# EasyEDA Pro project 自动泊车系统_2025-07-10.epro

# Schematic Schematic1
Board Name: Board1; Create Date: 2025-05-09; Page Name: P1_1; Project Name: 自动泊车系统; Schematic Name: Schematic1; Update Date: 2025-05-11; Add into BOM: yes; Company: 深圳嘉立创科技发展有限公司; Convert to PCB: yes; Drawed: 嘉立创EDA; Page Size: A3; Part Number: JLCPCB-001; Reviewed: 嘉立创EDA; Version: V0.1
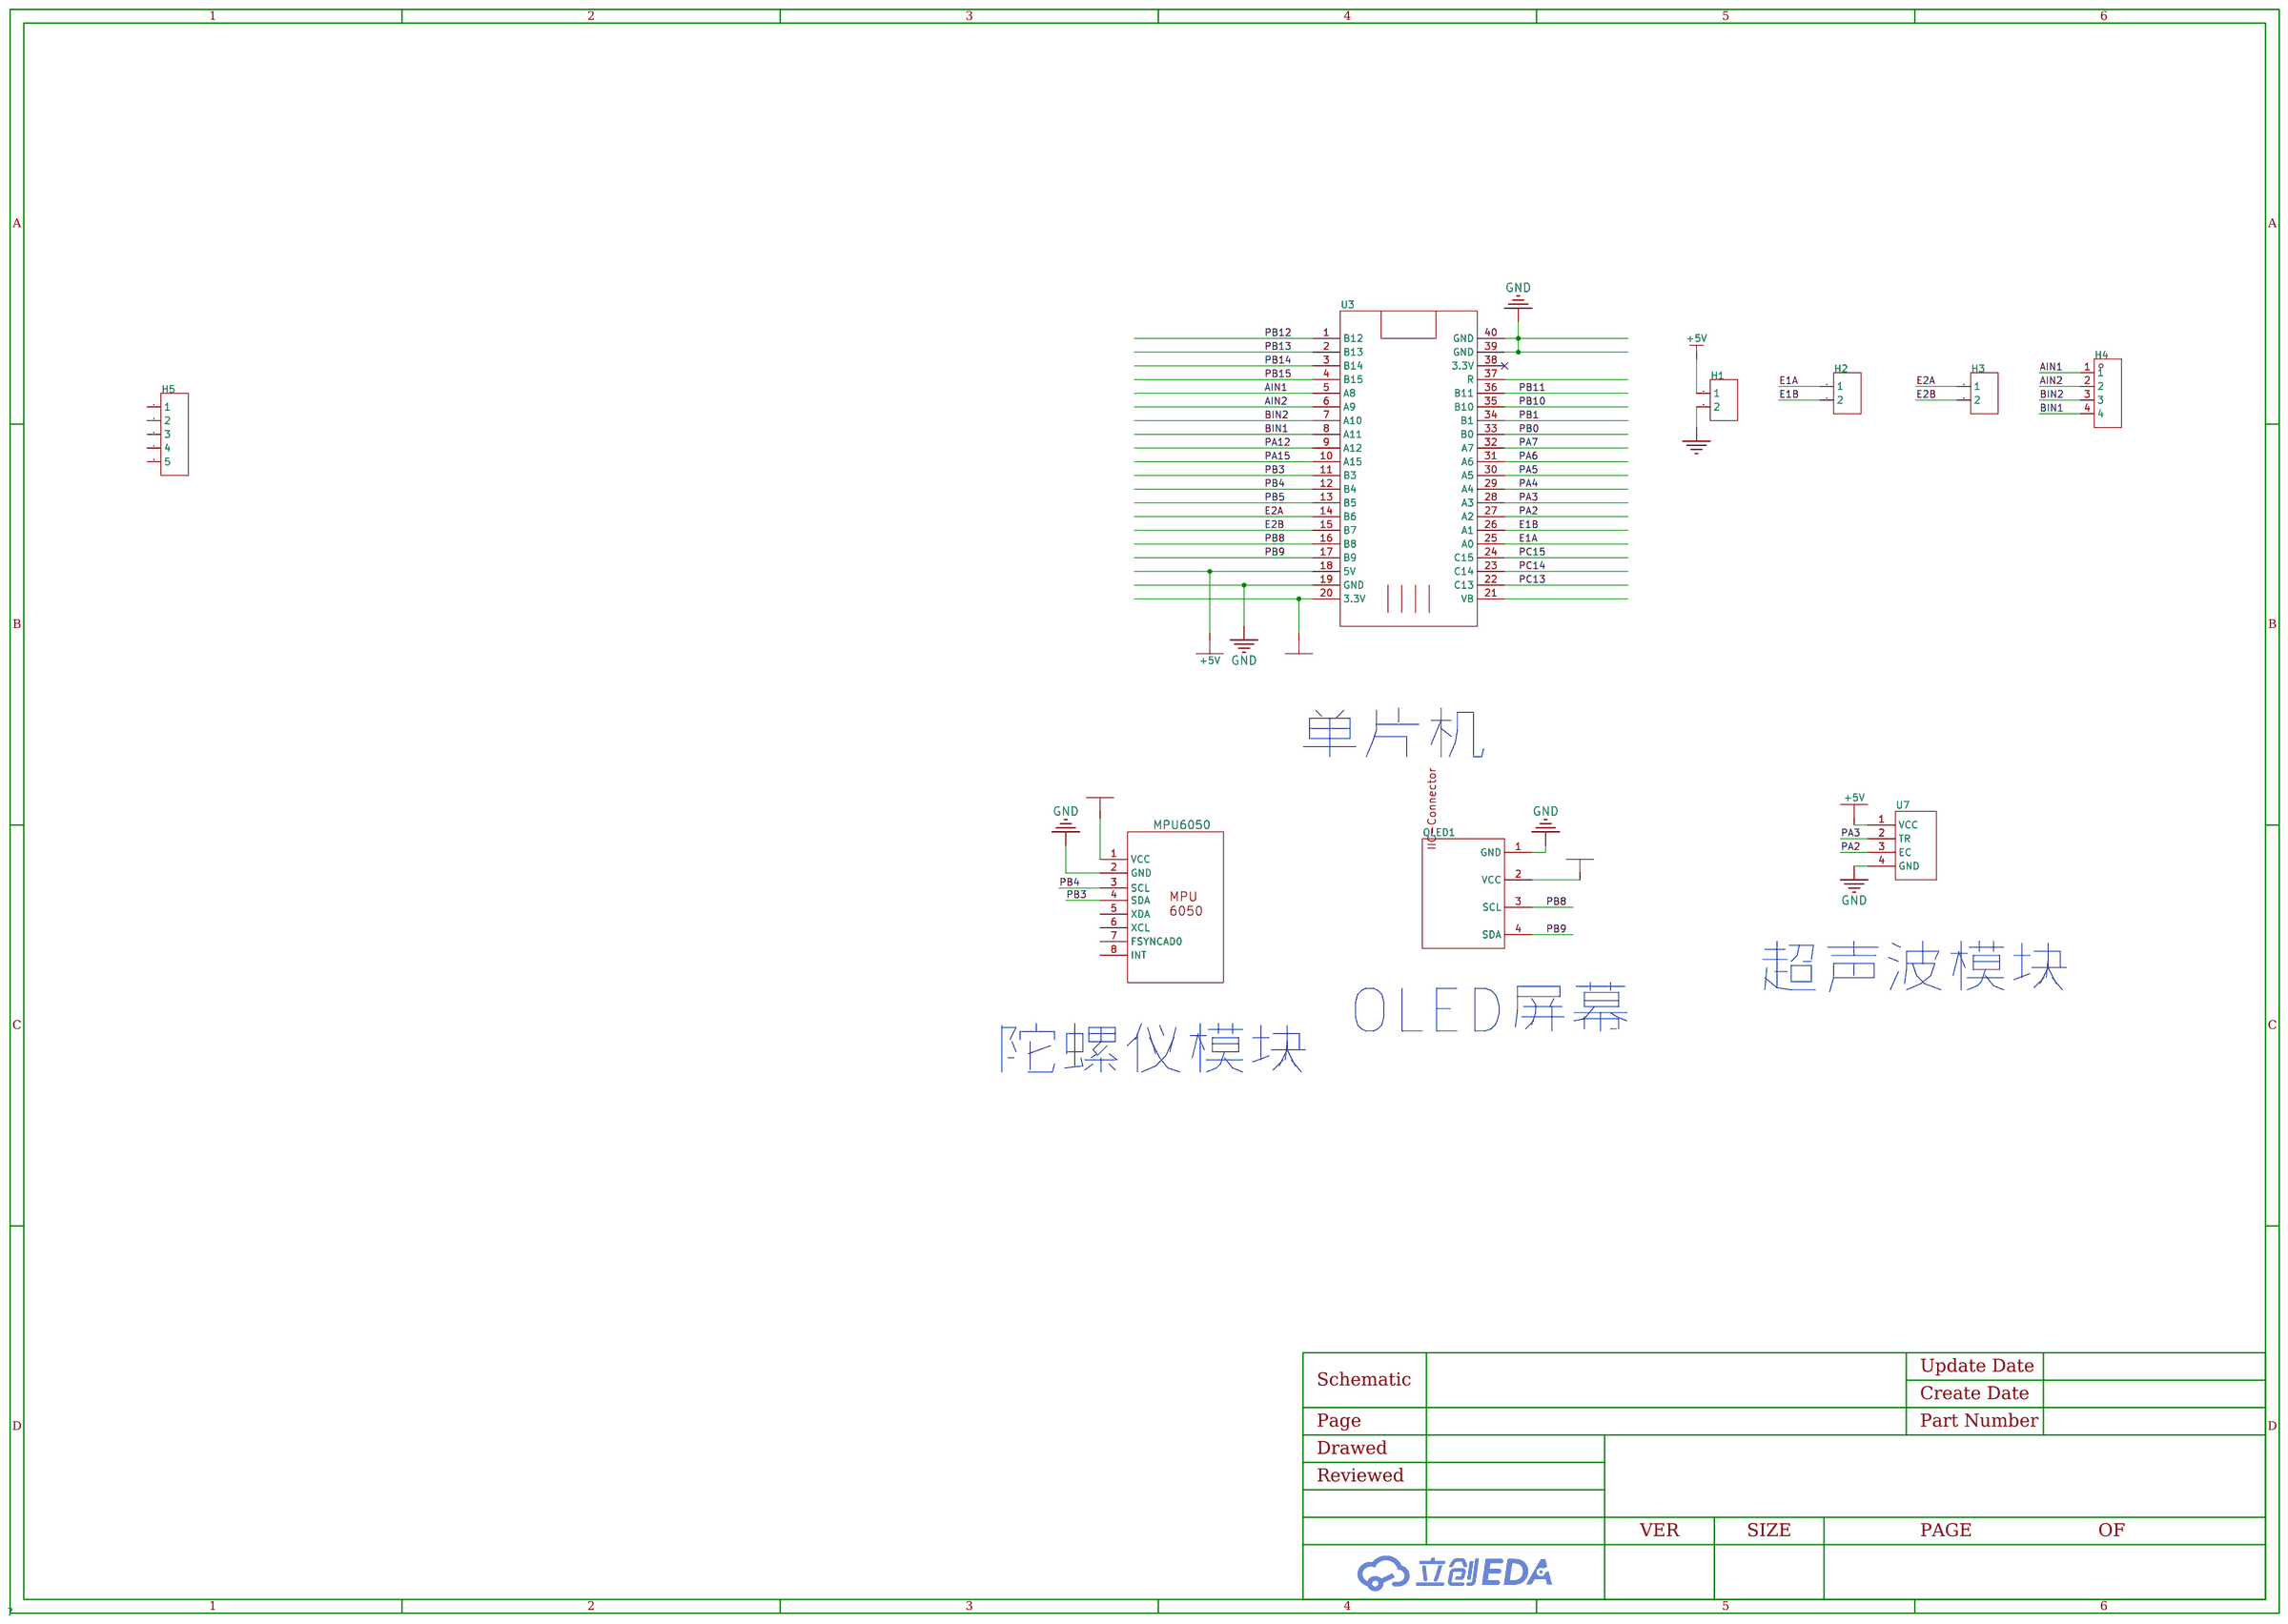
[diagram p0: schematic sheet]

## Parts
H1  -  [HDR-TH_2P-P2.54-V-F]
H2  -  [HDR-TH_2P-P2.54-V-F]
H3  -  [HDR-TH_2P-P2.54-V-F]
H4  -  [HDR-TH_4P-P2.54-V-F]
H5  -  [HDR-TH_5P-P2.54-V-F]
OLED1  -  [0.96OLED_4P]
P1  MPU6050  [MPU6050]
U3  -  [STM32F103C8T6核心板]
U7  -  [排母-4P]

## Library data of the parts
H1-H3 = HDR-F_2.54_1x2P: Supplier Part: C49661; Supplier Footprint: 插件
H4 = HDR-F_2.54_1x4P: Supplier Part: C2718488; Supplier Footprint: 插件
H5 = HDR-F_2.54_1x5P: Supplier Part: C50950; Supplier Footprint: 插件
OLED1 = 0.96OLED_4P: LCSC Part Name: 0.96OLED_4P_MODULE_JX; Supplier Part: C9900004566; Manufacturer Part: 0.96OLED_4P_MODULE_JX; Supplier Footprint: THrough hole; JLCPCB Part Class: Extended Part; Supplier: LCSC
P1 = MPU6050
U3 = stm32f103c8t6最小系统板
U7 = HC-SR04_1

## Nets
+3.3V: OLED1.2(VCC) P1.1(VCC) U3.20(3.3V)
+5V: H1.1 U3.18(5V) U7.1(VCC)
GND: H1.2 OLED1.1(GND) P1.2(GND) U3.19(GND) U3.39(GND) U3.40(GND) U7.4(GND)
AIN1: H4.1 U3.5(A8)
AIN2: H4.2 U3.6(A9)
BIN1: H4.4 U3.8(A11)
BIN2: H4.3 U3.7(A10)
E1A: H2.1 U3.25(A0)
E1B: H2.2 U3.26(A1)
E2A: H3.1 U3.14(B6)
E2B: H3.2 U3.15(B7)
PA2: U3.27(A2) U7.3(EC)
PA3: U3.28(A3) U7.2(TR)
PA4: U3.29(A4)
PA5: U3.30(A5)
PA6: U3.31(A6)
PA7: U3.32(A7)
PA12: U3.9(A12)
PA15: U3.10(A15)
PB0: U3.33(B0)
PB1: U3.34(B1)
PB3: P1.4(SDA) U3.11(B3)
PB4: P1.3(SCL) U3.12(B4)
PB5: U3.13(B5)
PB8: OLED1.3(SCL) U3.16(B8)
PB9: OLED1.4(SDA) U3.17(B9)
PB10: U3.35(B10)
PB11: U3.36(B11)
PB12: U3.1(B12)
PB13: U3.2(B13)
PB14: U3.3(B14)
PB15: U3.4(B15)
PC13: U3.22(C13)
PC14: U3.23(C14)
PC15: U3.24(C15)

Not connected (* = marked no-connect by the designer): H5 1 2 3 4 5; P1 5(XDA) 6(XCL) 7(FSYNCAD0) 8(INT); U3 21(VB) 37(R) 38(3.3V)*

## Notes on the sheet
- 单片机
- 超声波模块
- OLED屏幕
- 陀螺仪模块

# Board PCB1
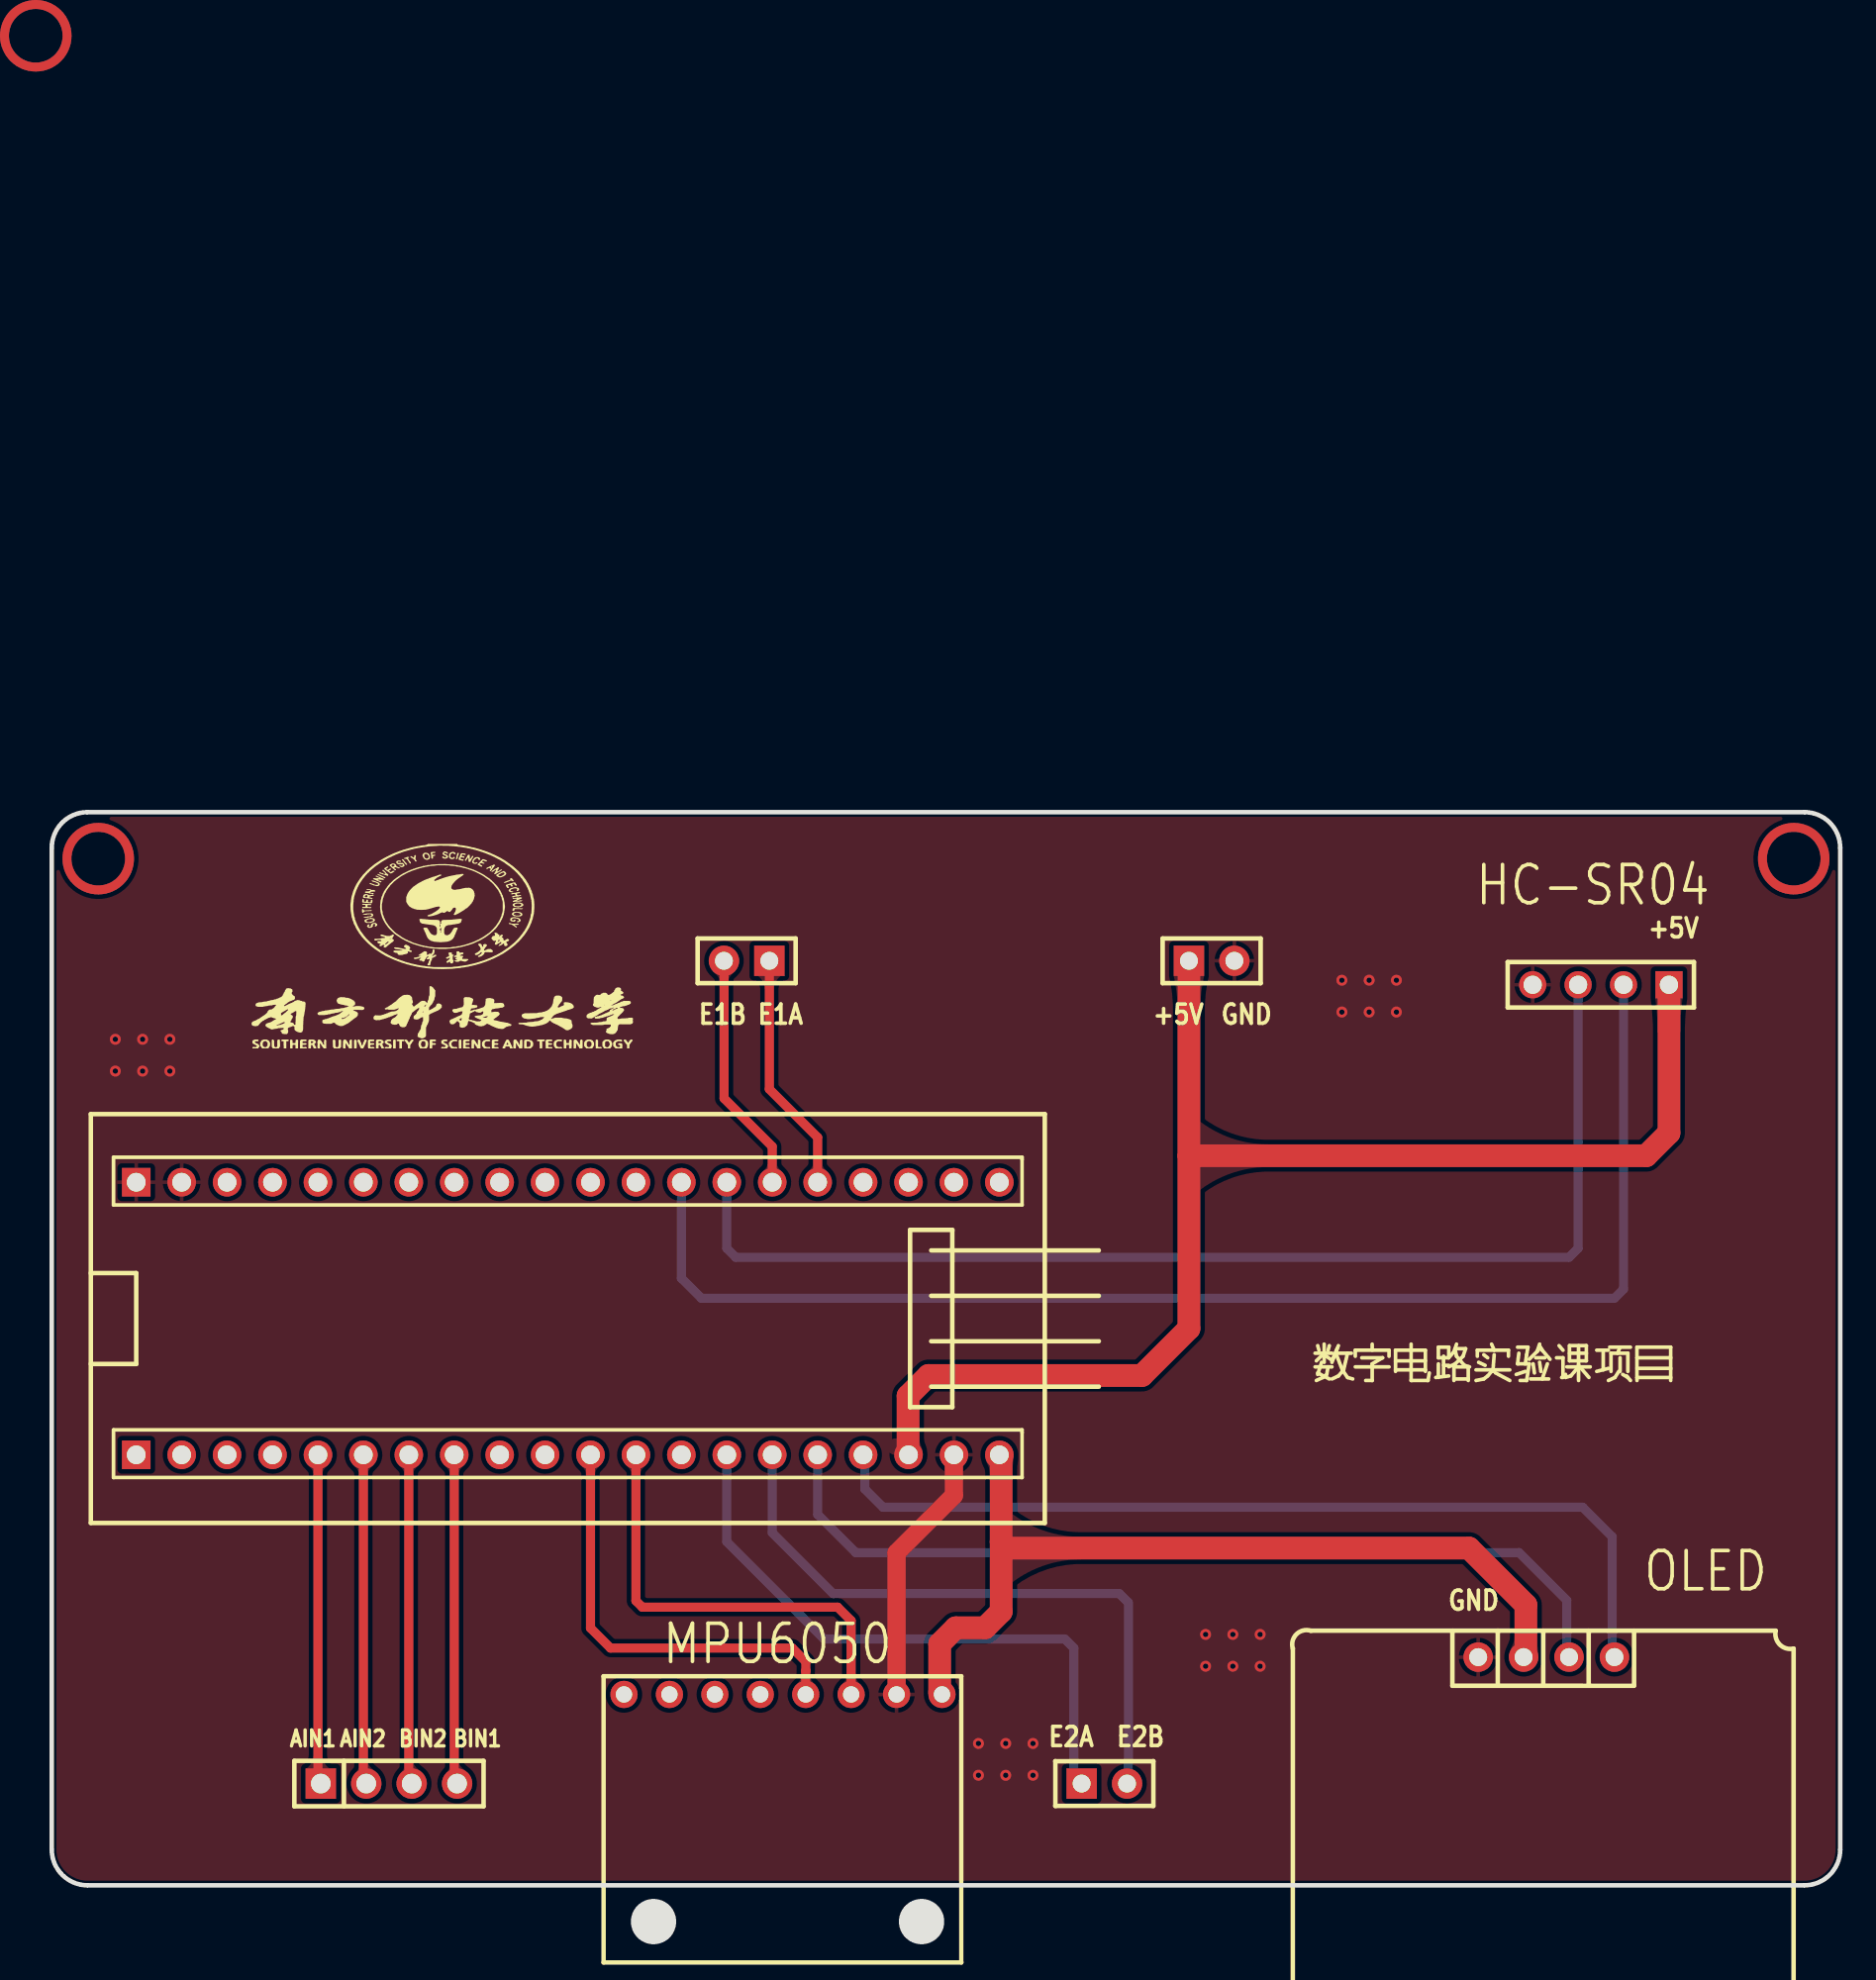
[diagram p1: board, top side]
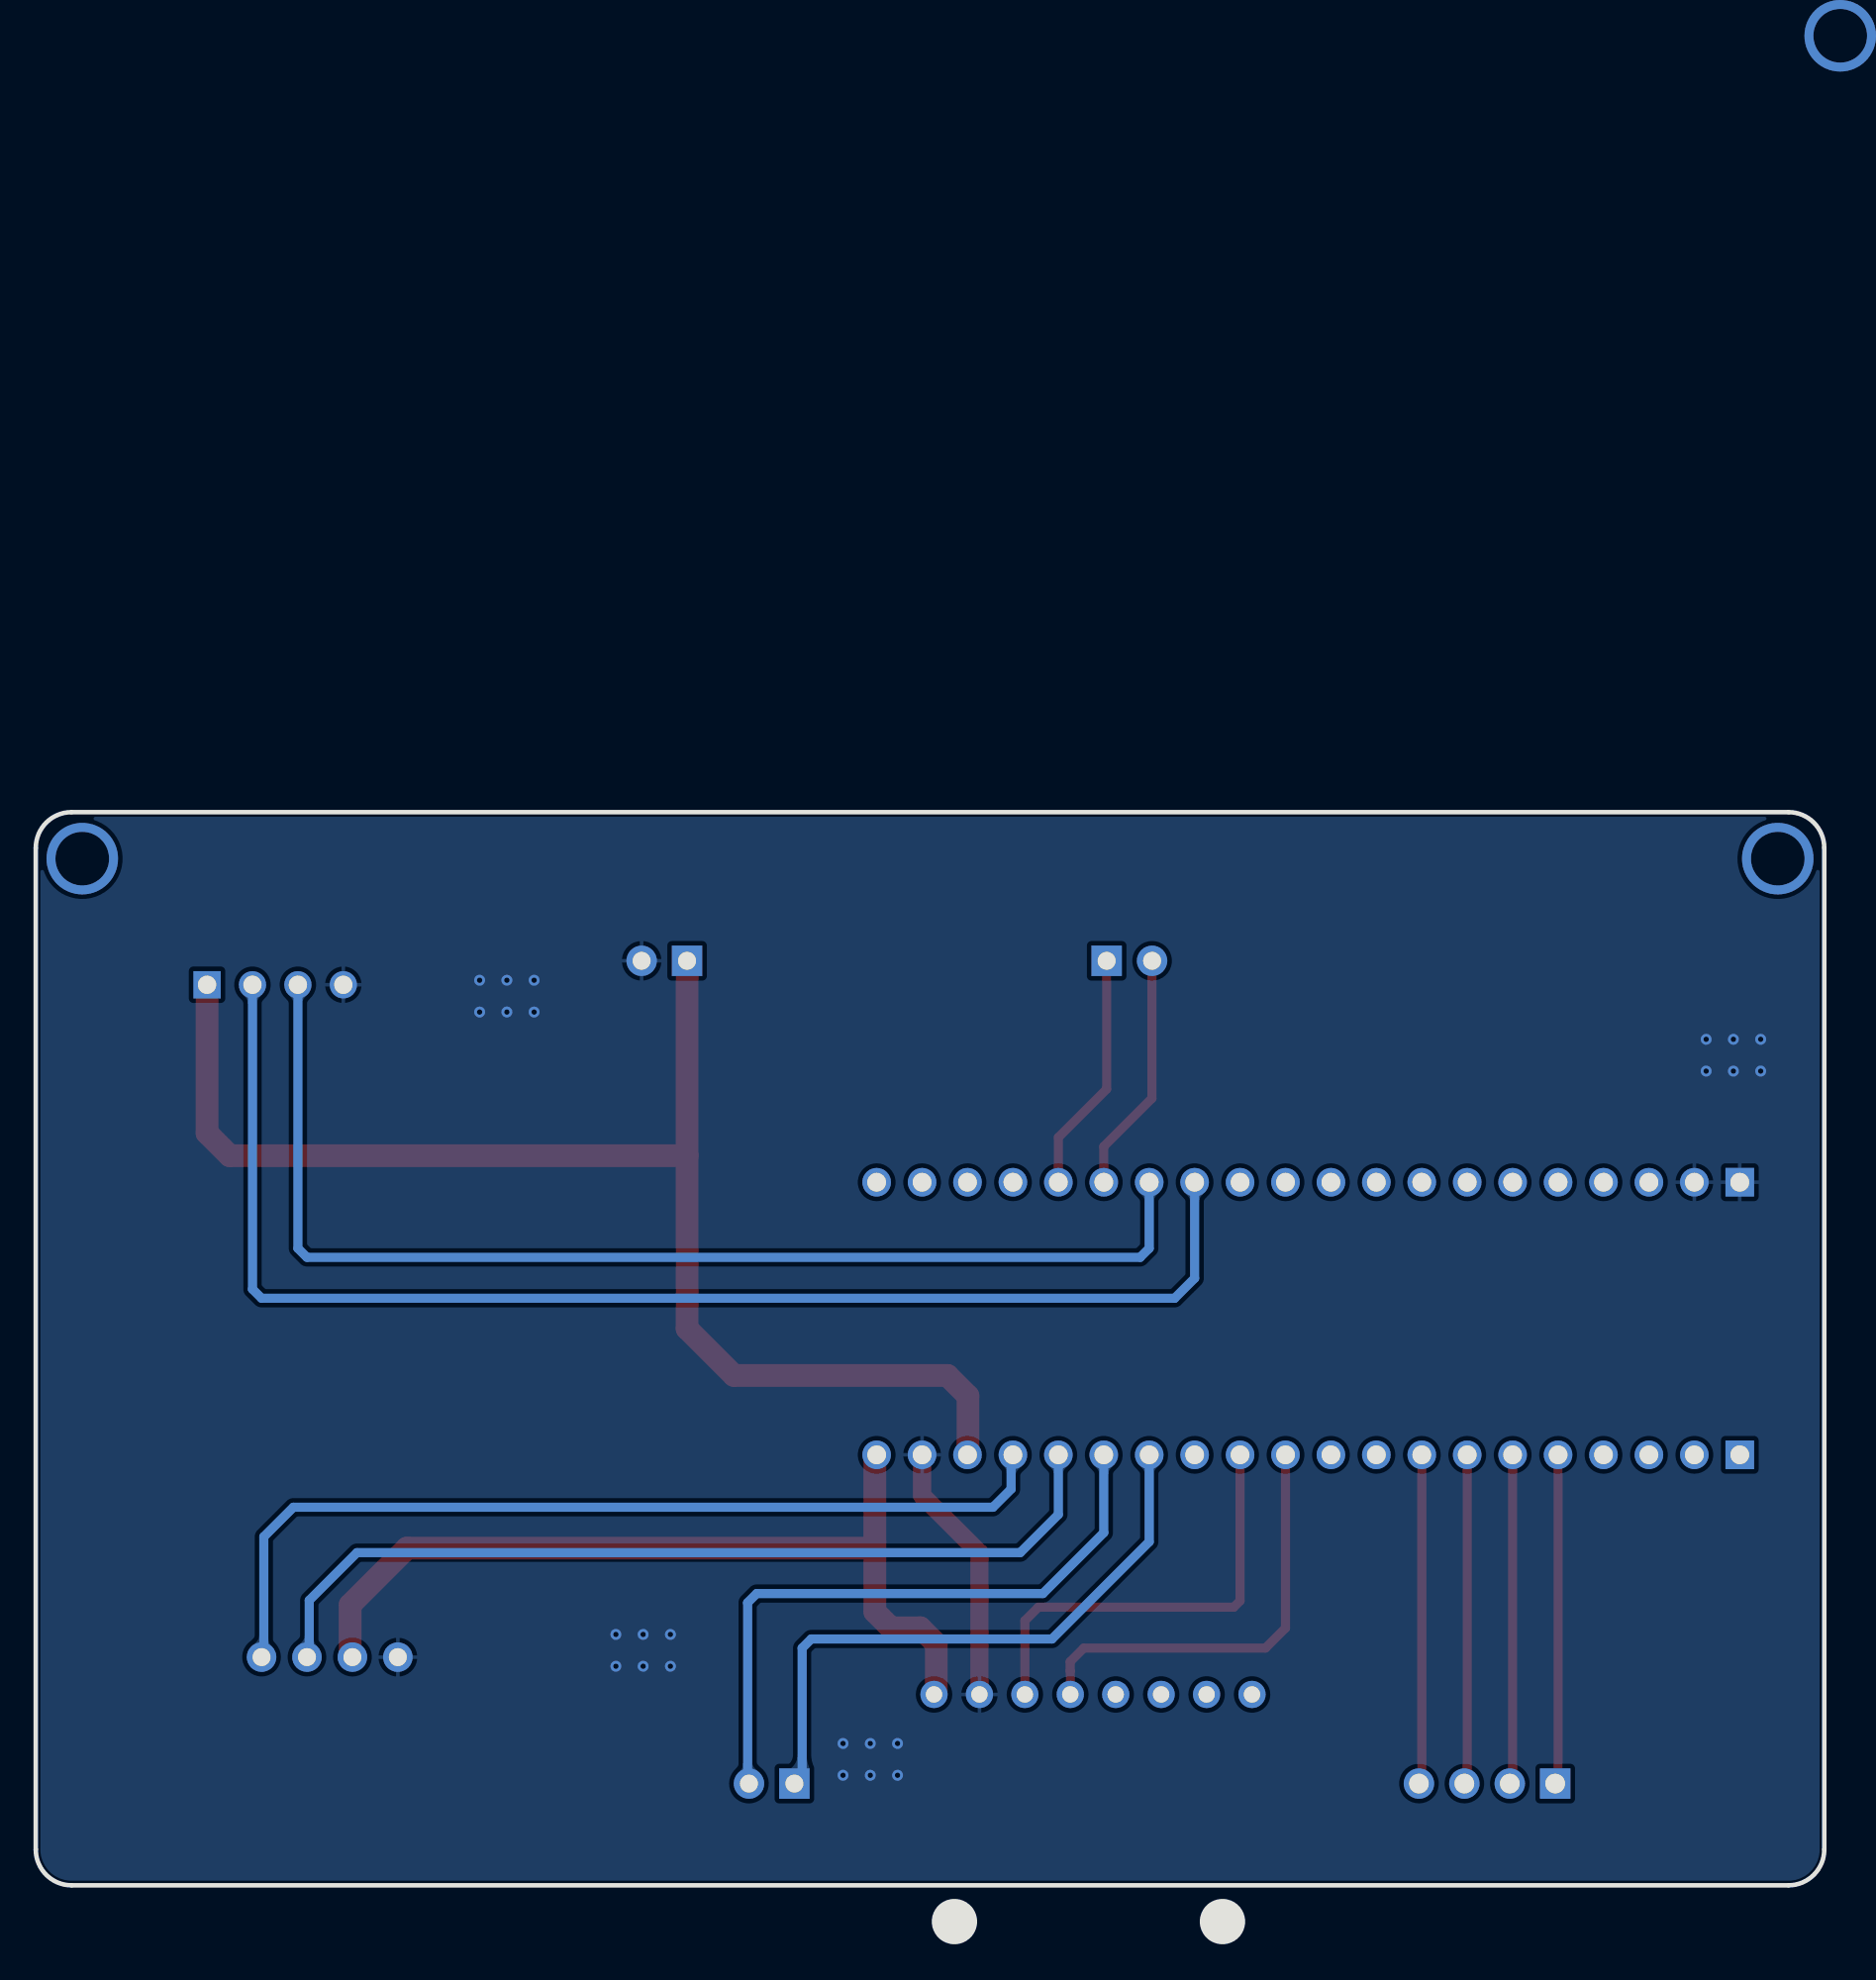
[diagram p2: board, bottom side, seen from below]

Outline 100 x 63.29 mm; copper layers: Top Layer, Bottom Layer. Coordinates in mm from the lower left corner of the outline.
Outline path: 0,61.29 0,5.29 arc(0.59,3.88) 2,3.29 98,3.29 arc(99.41,3.88) 100,5.29 100,61.29 arc(99.41,62.71) 98,63.29 2,63.29 arc(0.59,62.71) 0,61.29
Stack: Top Layer 0.035mm / Dielectric1 1.51mm FR4 er 4.5 / Bottom Layer 0.035mm

## Design rules (mm)
template: JLCPCB Capability(Two Layers Board)
spacing copperThickness1oz (default): track to track 0.102, other pairs 0.152 to 0.3
spacing copperThickness2oz: track to track 0.203, other pairs 0.152 to 0.3
track width copperThickness1oz (default): min 0.127, default 0.254, max 2.54
track width copperThickness2oz: min 0.203, default 0.254, max 2.54
differential pair differentialPair (default): width min 0.127, default 0.254, max 2.54; gap min 0.152, default 0.152
via viaSize (default): diameter min 0.5, default 0.61, max 10; hole min 0.3, default 0.305, max 6.3

## Placement (name value [footprint] x y rotation side)
H1  -  [HDR-TH_2P-P2.54-V-F]  64.85 54.98 0 top
H2  -  [HDR-TH_2P-P2.54-V-F]  38.85 54.98 180 top
H3  -  [HDR-TH_2P-P2.54-V-F]  58.85 8.98 0 top
H4  -  [HDR-TH_4P-P2.54-V-F]  18.85 8.98 0 top
OLED1  -  [0.96OLED_4P]  83.57 16.05 0 top
P1  -  [MPU6050]  30.85 14.98 270 top
U3  -  [STM32F103C8T6核心板]  28.85 34.98 90 top
U7  -  [排母-4P]  90.42 53.64 180 top

## Footprints (pads in the part's own frame, mm; a bottom-side part is the same pattern mirrored in y, then rotated)
0.96OLED_4P
  round 1.651 hole 1.001: 1(-3.81,0) 2(-1.27,0.003) 3(1.27,0.003) 4(3.81,0.003)
HDR-TH_2P-P2.54-V-F
  rect 1.7x1.7 hole 1: 1(-1.27,0)
  round 1.7 hole 1: 2(1.27,0)
HDR-TH_4P-P2.54-V-F
  rect 1.7x1.7 hole 1.1: 1(-3.81,0)
  round 1.7 hole 1.1: 2(-1.27,0) 3(1.27,0) 4(3.81,0)
MPU6050
  round 1.524 hole 0.914: 1(1.016,18.923) 2(1.016,16.383) 3(1.016,13.843) 4(1.016,11.303) 5(1.016,8.763) 6(1.016,6.223) 7(1.016,3.683) 8(1.016,1.143)
STM32F103C8T6核心板
  rect 1.6x1.6 hole 1.049: 1(-7.62,24.13) 40(7.62,24.13)
  round 1.6 hole 1.049: 2(-7.62,21.59) 3(-7.62,19.05) 4(-7.62,16.51) 5(-7.62,13.97) 6(-7.62,11.43) 7(-7.62,8.89) 8(-7.62,6.35) 9(-7.62,3.81) 10(-7.62,1.27) 11(-7.62,-1.27) 12(-7.62,-3.81) 13(-7.62,-6.35) 14(-7.62,-8.89) 15(-7.62,-11.43) 16(-7.62,-13.97) 17(-7.62,-16.51) 18(-7.62,-19.05) 19(-7.62,-21.59) 20(-7.62,-24.13) 21(7.62,-24.13) 22(7.62,-21.59) 23(7.62,-19.05) 24(7.62,-16.51) 25(7.62,-13.97) 26(7.62,-11.43) 27(7.62,-8.89) 28(7.62,-6.35) 29(7.62,-3.81) 30(7.62,-1.27) 31(7.62,1.27) 32(7.62,3.81) 33(7.62,6.35) 34(7.62,8.89) 35(7.62,11.43) 36(7.62,13.97) 37(7.62,16.51) 38(7.62,19.05) 39(7.62,21.59)
排母-4P
  rect 1.524x1.524 hole 1.02: 1(0,0)
  round 1.524 hole 1.02: 2(2.54,0) 3(5.08,0) 4(7.62,0)

## Nets
As in the schematic.

Pads without a net: P1 5 6 7 8; U3 38

## Via types
v1: diameter 4, hole 3, Top Layer to Bottom Layer, 3 vias
v2: diameter 0.61, hole 0.305, Top Layer to Bottom Layer, 24 vias

## Routing (per net, layer and track width the routed paths; a pad name or vN(x,y) marks a point on that pad's centre or on a via; arc(x,y) is an arc through that point)
+3.3V: length 49.6
  Top Layer w1.27: 53.09,22.5 53.44,22.15 79.25,22.15 82.42,18.97 82.42,16.18 OLED1.2 ; 53.09,22.5 53.09,27.26 U3.20 ; 53.09,22.5 53.09,18.59 52.19,17.69 50.55,17.69 49.65,16.79 49.65,14.1 49.78,13.97
+5V: length 76.8
  Top Layer w1.27: H1.1 63.58,44.08 ; 63.58,44.08 89.15,44.08 90.42,45.35 U7.1 ; 63.58,44.08 63.58,34.42 60.96,31.8 49.02,31.8 47.88,30.66 47.88,27.39 U3.18
GND: length 14.7
  Top Layer w1.016: U3.19 50.44,25.09 47.24,21.89 47.24,13.97
  vias: v2(3.56,50.59) v2(3.56,48.82) v2(5.08,50.59) v2(5.08,48.82) v2(6.6,50.59) v2(6.6,48.82) v2(51.82,11.22) v2(51.82,9.45) v2(53.34,11.22) v2(53.34,9.45) v2(54.86,11.22) v2(54.86,9.45) v2(64.52,17.32) v2(64.52,15.54) v2(66.04,17.32) v2(66.04,15.54) v2(67.56,17.32) v2(67.56,15.54) v2(72.14,53.9) v2(72.14,52.12) v2(73.66,53.9) v2(73.66,52.12) v2(75.18,53.9) v2(75.18,52.12)
(no net):
  vias: v1(-0.89,106.7) v1(2.6,60.69) v1(97.4,60.69)
AIN1: length 18.4
  Top Layer w0.508: U3.5 14.88,9.14 H4.1
AIN2: length 18.4
  Top Layer w0.508: U3.6 17.42,9.14 H4.2
BIN1: length 18.4
  Top Layer w0.508: U3.8 22.5,9.14 H4.4
BIN2: length 18.4
  Top Layer w0.508: H4.3 19.96,9.14 U3.7
E1A: length 13.5
  Top Layer w0.508: U3.25 42.82,45.11 40.12,47.81 H2.1
E1B: length 13.5
  Top Layer w0.508: U3.26 40.28,44.6 37.59,47.29 37.59,54.97 H2.2
E2A: length 34.5
  Bottom Layer w0.508: H3.1 57.15,9.42 57.15,16.56 56.64,17.07 43.18,17.07 37.74,22.5 U3.14
E2B: length 36
  Bottom Layer w0.508: H3.2 60.2,9.06 60.2,19.1 59.69,19.61 43.69,19.61 40.28,23.01 U3.15
PA2: length 66.4
  Bottom Layer w0.508: U7.3 85.34,38.91 84.84,38.4 38.25,38.4 37.74,38.91 U3.27
PA3: length 75.7
  Bottom Layer w0.508: U7.2 87.88,36.62 87.38,36.12 36.32,36.12 35.2,37.23 U3.28
PB3: length 24.3
  Top Layer w0.508: U3.11 30.12,17.68 31.24,16.56 41.4,16.56 42.16,15.8 42.16,15.29 42.16,15.28 P1.4
PB4: length 24.8
  Top Layer w0.508: U3.12 32.66,19.2 33.02,18.84 43.94,18.84 44.7,18.09 P1.3
PB8: length 50.4
  Bottom Layer w0.508: U3.16 42.82,24.03 44.96,21.89 82.04,21.89 84.71,19.23 84.71,16.18 OLED1.3
PB9: length 51.6
  Bottom Layer w0.508: OLED1.4 87.25,16.18 87.25,22.78 85.6,24.43 46.48,24.43 45.47,25.45 45.47,27.26 U3.17

## Copper pours and planes (outline as drawn; the poured copper is in the pictures)
GND on Top Layer: -7.11,69.39 113.03,69.39 113.03,-13.67 -7.11,-13.67
GND on Bottom Layer: -9.65,70.91 113.54,70.91 113.54,-12.14 -9.65,-12.14

Small or netless copper shapes (teardrops, artwork), in the pictures only: 26 on Top Layer, 12 on Bottom Layer

## Text on the board
Top Silkscreen Layer: AIN1 | AIN2 | BIN2 | BIN1 | E1B | E1A | E2A | E2B | +5V | GND | MPU6050 | HC-SR04 | OLED | 数字电路实验课项目
